# Altium schematic sheet led and buttons.schdoc
size 407 x 238 mm
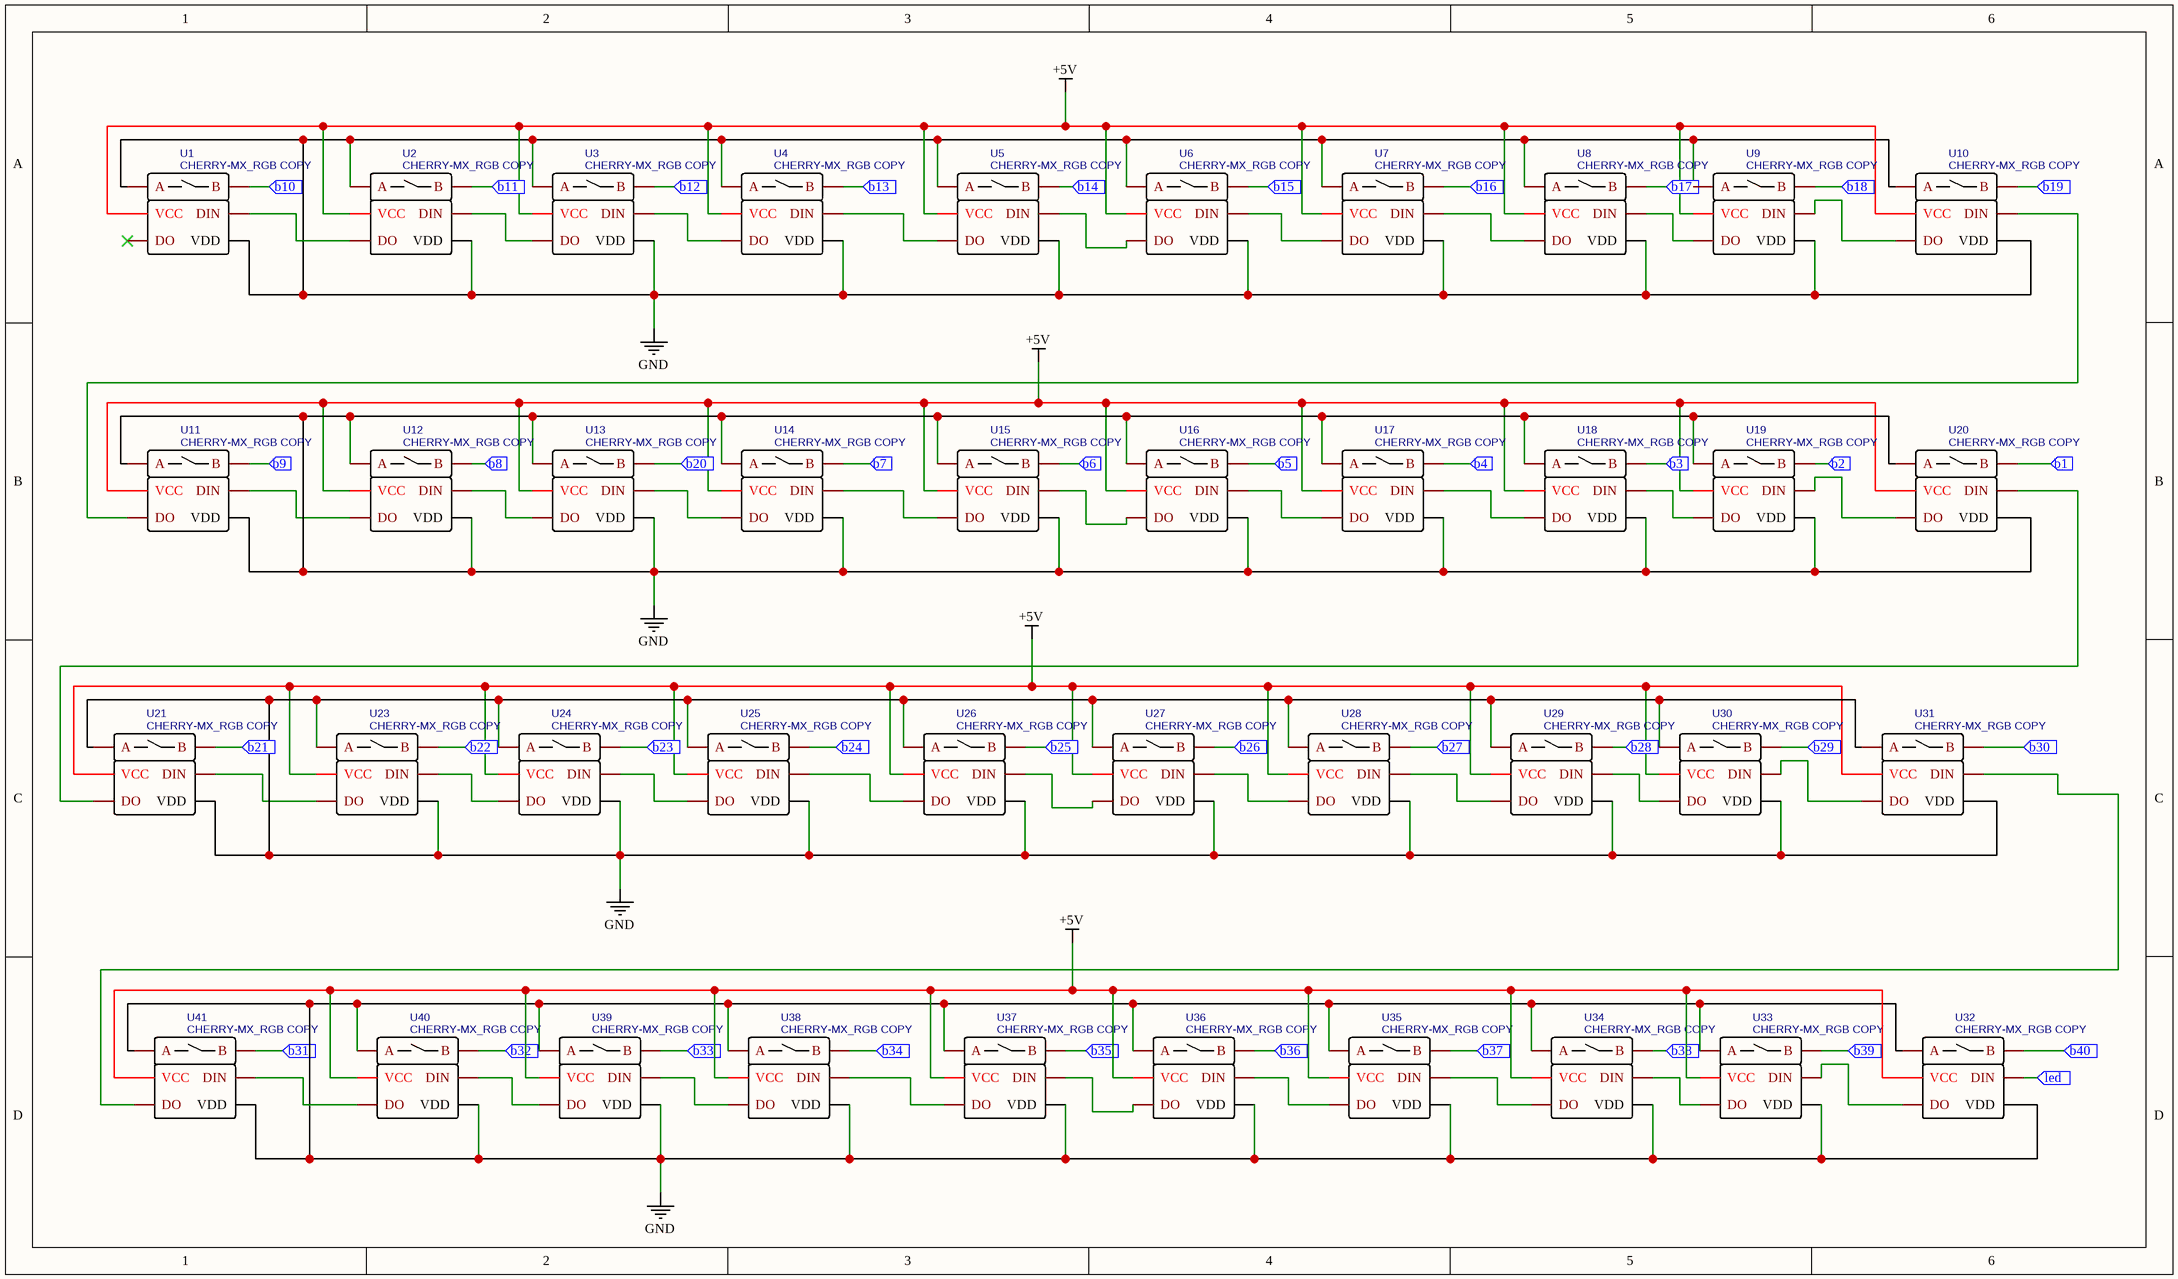
[diagram p0: led and buttons.schdoc]

## Parts
U1  CHERRY-MX_RGB COPY  [CHERRY-MX-RGB]
U2  CHERRY-MX_RGB COPY  [CHERRY-MX-RGB]
U3  CHERRY-MX_RGB COPY  [CHERRY-MX-RGB]
U4  CHERRY-MX_RGB COPY  [CHERRY-MX-RGB]
U5  CHERRY-MX_RGB COPY  [CHERRY-MX-RGB]
U6  CHERRY-MX_RGB COPY  [CHERRY-MX-RGB]
U7  CHERRY-MX_RGB COPY  [CHERRY-MX-RGB]
U8  CHERRY-MX_RGB COPY  [CHERRY-MX-RGB]
U9  CHERRY-MX_RGB COPY  [CHERRY-MX-RGB]
U10  CHERRY-MX_RGB COPY  [CHERRY-MX-RGB]
U11  CHERRY-MX_RGB COPY  [CHERRY-MX-RGB]
U12  CHERRY-MX_RGB COPY  [CHERRY-MX-RGB]
U13  CHERRY-MX_RGB COPY  [CHERRY-MX-RGB]
U14  CHERRY-MX_RGB COPY  [CHERRY-MX-RGB]
U15  CHERRY-MX_RGB COPY  [CHERRY-MX-RGB]
U16  CHERRY-MX_RGB COPY  [CHERRY-MX-RGB]
U17  CHERRY-MX_RGB COPY  [CHERRY-MX-RGB]
U18  CHERRY-MX_RGB COPY  [CHERRY-MX-RGB]
U19  CHERRY-MX_RGB COPY  [CHERRY-MX-RGB]
U20  CHERRY-MX_RGB COPY  [CHERRY-MX-RGB]
U21  CHERRY-MX_RGB COPY  [CHERRY-MX-RGB]
U23  CHERRY-MX_RGB COPY  [CHERRY-MX-RGB]
U24  CHERRY-MX_RGB COPY  [CHERRY-MX-RGB]
U25  CHERRY-MX_RGB COPY  [CHERRY-MX-RGB]
U26  CHERRY-MX_RGB COPY  [CHERRY-MX-RGB]
U27  CHERRY-MX_RGB COPY  [CHERRY-MX-RGB]
U28  CHERRY-MX_RGB COPY  [CHERRY-MX-RGB]
U29  CHERRY-MX_RGB COPY  [CHERRY-MX-RGB]
U30  CHERRY-MX_RGB COPY  [CHERRY-MX-RGB]
U31  CHERRY-MX_RGB COPY  [CHERRY-MX-RGB]
U32  CHERRY-MX_RGB COPY  [CHERRY-MX-RGB]
U33  CHERRY-MX_RGB COPY  [CHERRY-MX-RGB]
U34  CHERRY-MX_RGB COPY  [CHERRY-MX-RGB]
U35  CHERRY-MX_RGB COPY  [CHERRY-MX-RGB]
U36  CHERRY-MX_RGB COPY  [CHERRY-MX-RGB]
U37  CHERRY-MX_RGB COPY  [CHERRY-MX-RGB]
U38  CHERRY-MX_RGB COPY  [CHERRY-MX-RGB]
U39  CHERRY-MX_RGB COPY  [CHERRY-MX-RGB]
U40  CHERRY-MX_RGB COPY  [CHERRY-MX-RGB]
U41  CHERRY-MX_RGB COPY  [CHERRY-MX-RGB]

## Ports
b1 (in), b2 (in), b3 (in), b4 (in), b5 (in), b6 (in), b7 (in), b8 (in), b9 (in), b10 (in), b11 (in), b12 (in), b13 (in), b14 (in), b15 (in), b16 (in), b17 (in), b18 (in), b19 (in), b20 (in), b21 (in), b22 (in), b23 (in), b24 (in), b25 (in), b26 (in), b27 (in), b28 (in), b29 (in), b30 (in), b31 (in), b32 (in), b33 (in), b34 (in), b35 (in), b36 (in), b37 (in), b38 (in), b39 (in), b40 (in), led (in)

## Nets
+5V: U1.3(VCC) U2.3(VCC) U3.3(VCC) U4.3(VCC) U5.3(VCC) U6.3(VCC) U7.3(VCC) U8.3(VCC) U9.3(VCC) U10.3(VCC) U11.3(VCC) U12.3(VCC) U13.3(VCC) U14.3(VCC) U15.3(VCC) U16.3(VCC) U17.3(VCC) U18.3(VCC) U19.3(VCC) U20.3(VCC) U21.3(VCC) U23.3(VCC) U24.3(VCC) U25.3(VCC) U26.3(VCC) U27.3(VCC) U28.3(VCC) U29.3(VCC) U30.3(VCC) U31.3(VCC) U32.3(VCC) U33.3(VCC) U34.3(VCC) U35.3(VCC) U36.3(VCC) U37.3(VCC) U38.3(VCC) U39.3(VCC) U40.3(VCC) U41.3(VCC)
GND: U1.1(A) U1.5(VDD) U2.1(A) U2.5(VDD) U3.1(A) U3.5(VDD) U4.1(A) U4.5(VDD) U5.1(A) U5.5(VDD) U6.1(A) U6.5(VDD) U7.1(A) U7.5(VDD) U8.1(A) U8.5(VDD) U9.1(A) U9.5(VDD) U10.1(A) U10.5(VDD) U11.1(A) U11.5(VDD) U12.1(A) U12.5(VDD) U13.1(A) U13.5(VDD) U14.1(A) U14.5(VDD) U15.1(A) U15.5(VDD) U16.1(A) U16.5(VDD) U17.1(A) U17.5(VDD) U18.1(A) U18.5(VDD) U19.1(A) U19.5(VDD) U20.1(A) U20.5(VDD) U21.1(A) U21.5(VDD) U23.1(A) U23.5(VDD) U24.1(A) U24.5(VDD) U25.1(A) U25.5(VDD) U26.1(A) U26.5(VDD) U27.1(A) U27.5(VDD) U28.1(A) U28.5(VDD) U29.1(A) U29.5(VDD) U30.1(A) U30.5(VDD) U31.1(A) U31.5(VDD) U32.1(A) U32.5(VDD) U33.1(A) U33.5(VDD) U34.1(A) U34.5(VDD) U35.1(A) U35.5(VDD) U36.1(A) U36.5(VDD) U37.1(A) U37.5(VDD) U38.1(A) U38.5(VDD) U39.1(A) U39.5(VDD) U40.1(A) U40.5(VDD) U41.1(A) U41.5(VDD)
b1: U20.2(B) ; port b1
b2: U19.2(B) ; port b2
b3: U18.2(B) ; port b3
b4: U17.2(B) ; port b4
b5: U16.2(B) ; port b5
b6: U15.2(B) ; port b6
b7: U14.2(B) ; port b7
b8: U12.2(B) ; port b8
b9: U11.2(B) ; port b9
b10: U1.2(B) ; port b10
b11: U2.2(B) ; port b11
b12: U3.2(B) ; port b12
b13: U4.2(B) ; port b13
b14: U5.2(B) ; port b14
b15: U6.2(B) ; port b15
b16: U7.2(B) ; port b16
b17: U8.2(B) ; port b17
b18: U9.2(B) ; port b18
b19: U10.2(B) ; port b19
b20: U13.2(B) ; port b20
b21: U21.2(B) ; port b21
b22: U23.2(B) ; port b22
b23: U24.2(B) ; port b23
b24: U25.2(B) ; port b24
b25: U26.2(B) ; port b25
b26: U27.2(B) ; port b26
b27: U28.2(B) ; port b27
b28: U29.2(B) ; port b28
b29: U30.2(B) ; port b29
b30: U31.2(B) ; port b30
b31: U41.2(B) ; port b31
b32: U40.2(B) ; port b32
b33: U39.2(B) ; port b33
b34: U38.2(B) ; port b34
b35: U37.2(B) ; port b35
b36: U36.2(B) ; port b36
b37: U35.2(B) ; port b37
b38: U34.2(B) ; port b38
b39: U33.2(B) ; port b39
b40: U32.2(B) ; port b40
led: U32.6(DIN) ; port led
NetU1_6: U1.6(DIN) U2.4(DO)
NetU2_6: U2.6(DIN) U3.4(DO)
NetU3_6: U3.6(DIN) U4.4(DO)
NetU4_6: U4.6(DIN) U5.4(DO)
NetU5_6: U5.6(DIN) U6.4(DO)
NetU6_6: U6.6(DIN) U7.4(DO)
NetU7_6: U7.6(DIN) U8.4(DO)
NetU8_6: U8.6(DIN) U9.4(DO)
NetU9_6: U9.6(DIN) U10.4(DO)
NetU10_6: U10.6(DIN) U11.4(DO)
NetU11_6: U11.6(DIN) U12.4(DO)
NetU12_6: U12.6(DIN) U13.4(DO)
NetU13_6: U13.6(DIN) U14.4(DO)
NetU14_6: U14.6(DIN) U15.4(DO)
NetU15_6: U15.6(DIN) U16.4(DO)
NetU16_6: U16.6(DIN) U17.4(DO)
NetU17_6: U17.6(DIN) U18.4(DO)
NetU18_6: U18.6(DIN) U19.4(DO)
NetU19_6: U19.6(DIN) U20.4(DO)
NetU20_6: U20.6(DIN) U21.4(DO)
NetU21_6: U21.6(DIN) U23.4(DO)
NetU23_6: U23.6(DIN) U24.4(DO)
NetU24_6: U24.6(DIN) U25.4(DO)
NetU25_6: U25.6(DIN) U26.4(DO)
NetU26_6: U26.6(DIN) U27.4(DO)
NetU27_6: U27.6(DIN) U28.4(DO)
NetU28_6: U28.6(DIN) U29.4(DO)
NetU29_6: U29.6(DIN) U30.4(DO)
NetU30_6: U30.6(DIN) U31.4(DO)
NetU31_6: U31.6(DIN) U41.4(DO)
NetU32_4: U32.4(DO) U33.6(DIN)
NetU33_4: U33.4(DO) U34.6(DIN)
NetU34_4: U34.4(DO) U35.6(DIN)
NetU35_4: U35.4(DO) U36.6(DIN)
NetU36_4: U36.4(DO) U37.6(DIN)
NetU37_4: U37.4(DO) U38.6(DIN)
NetU38_4: U38.4(DO) U39.6(DIN)
NetU39_4: U39.4(DO) U40.6(DIN)
NetU40_4: U40.4(DO) U41.6(DIN)

Not connected (* = marked no-connect by the designer): U1 4(DO)*

## Library data of the parts
U1-U21 U23-U41 = CHERRY-MX_RGB COPY: Contributor: unrealin01; spicePre: U; spiceSymbolName: CHERRY-MX_RGB COPY